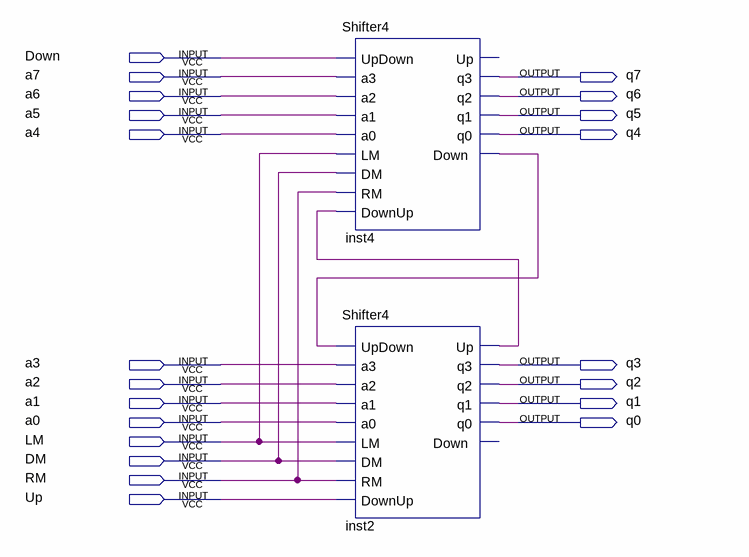
[diagram p0: schematic sheet]
// Quartus schematic Shifter8.bdf as structural Verilog: 2 symbols, 21 pins
module Shifter8 (
  input  Down,
  input  a7,
  input  a6,
  input  a5,
  input  a4,
  input  a3,
  input  a2,
  input  a1,
  input  a0,
  input  LM,
  input  DM,
  input  RM,
  input  Up,
  output q7,
  output q6,
  output q5,
  output q4,
  output q3,
  output q2,
  output q1,
  output q0
);

  wire inst2_up, inst4_down;

  Shifter4 inst4 (
    .UpDown(Down), .a3(a7), .a2(a6), .a1(a5), .a0(a4), .LM(LM), .DM(DM), .RM(RM), .DownUp(inst2_up), .q3(q7),
    .q2(q6), .q1(q5), .q0(q4), .Down(inst4_down));  // open: Up
  Shifter4 inst2 (
    .UpDown(inst4_down), .a3(a3), .a2(a2), .a1(a1), .a0(a0), .LM(LM), .DM(DM), .RM(RM), .DownUp(Up),
    .Up(inst2_up), .q3(q3), .q2(q2), .q1(q1), .q0(q0));  // open: Down
endmodule
